# Altium schematic sheet 1-History.SchDoc
size 246 x 182 mm
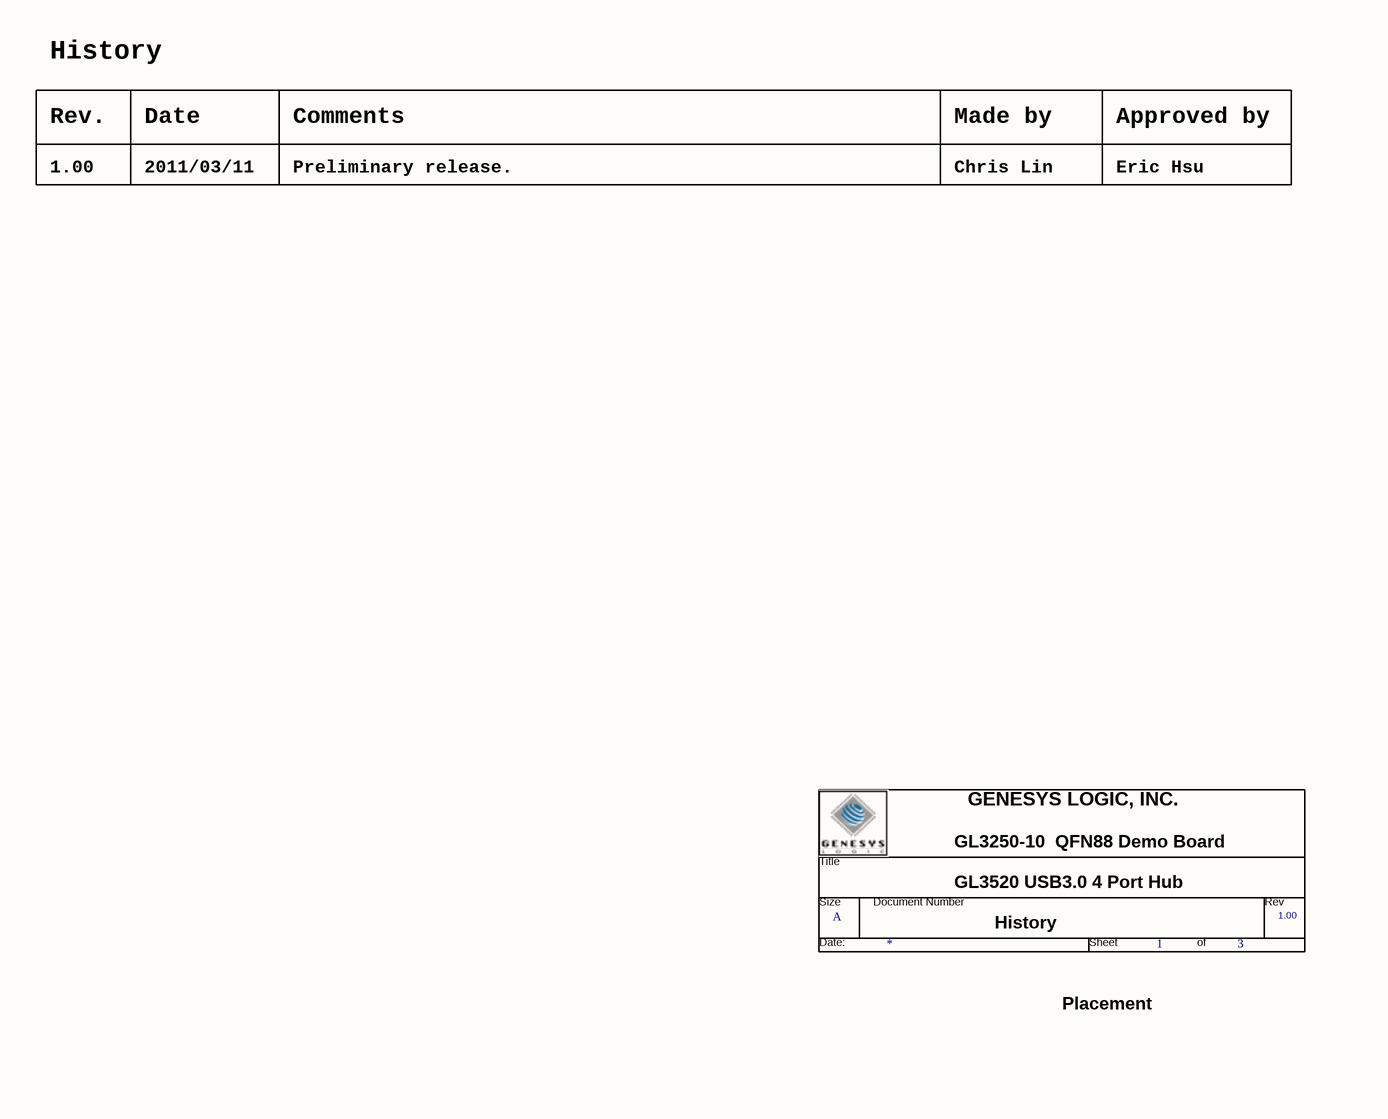
[diagram p0: 1-History.SchDoc, left]
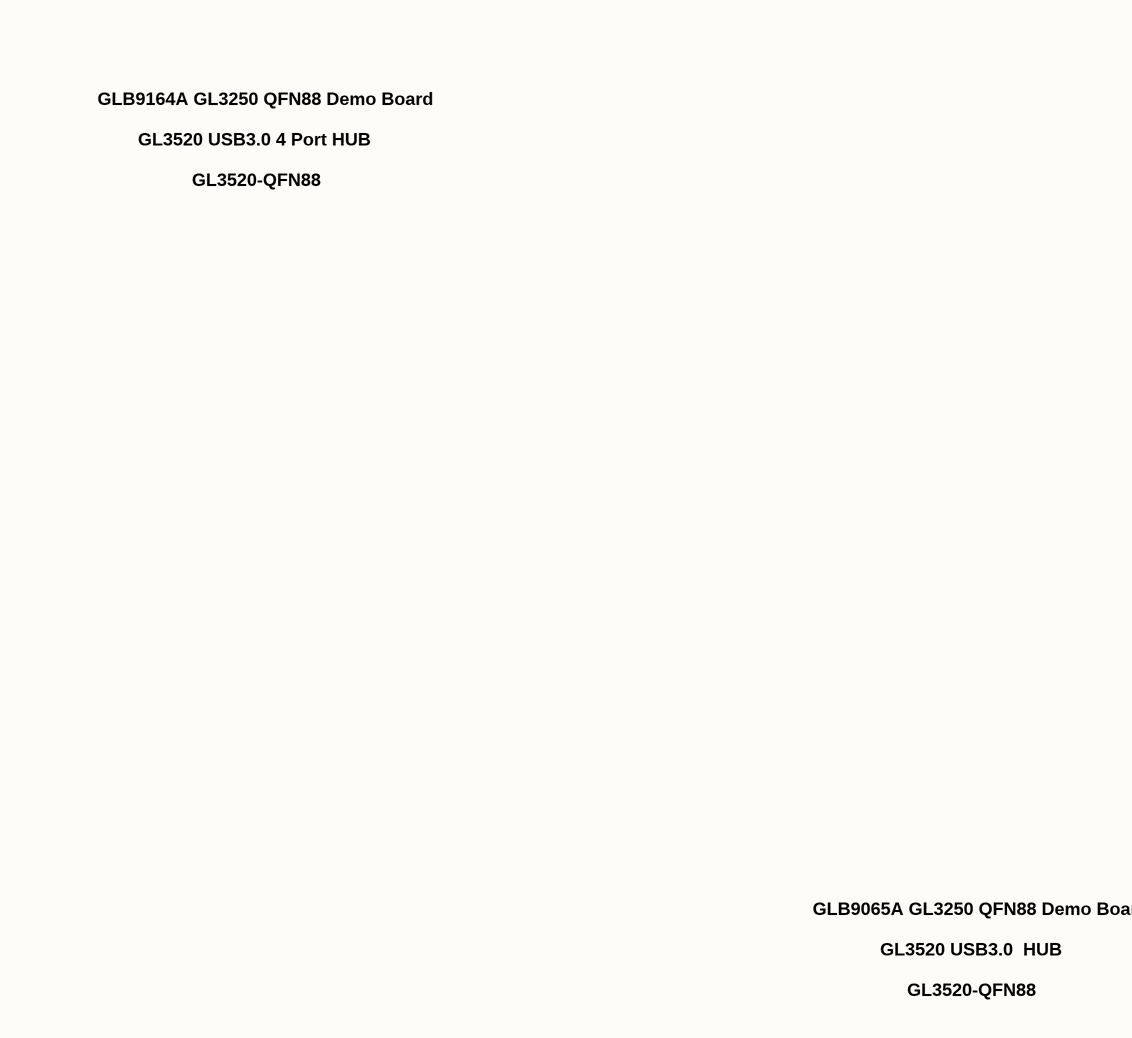
[diagram p1: 1-History.SchDoc, right]

## Parts
*  Page Count: 3  Page Number: 1  Page Size: A  RevCode: 1.00  (hidden comment: Genesys Logic TitleBlock)  (graphical)

## Notes on the sheet
- History
- Rev.
- 1.00
- 2011/03/11
- Date
- Comments
- Preliminary release.
- Chris Lin
- Made by
- Eric Hsu
- Approved by
- GL3250-10  QFN88 Demo Board
- GL3520 USB3.0 4 Port Hub
- Placement
- GLB9164A GL3250 QFN88 Demo Board
- GL3520 USB3.0 4 Port HUB
- GL3520-QFN88
- GLB9065A GL3250 QFN88 Demo Board
- GL3520 USB3.0  HUB
- (in symbol Genesys Logic TitleBlock) GENESYS LOGIC, INC.; Title; Size; Document Number; Rev; Date:; Sheet; of

## Library data of the parts
* = Genesys Logic TitleBlock: Page Create Date: March  8, 1995; Page Modify Date: *